# Altium schematic sheet ETH10M100M_RMII_DP83825.SchDoc
size A3; SheetNumber: 15; SheetTotal: 27
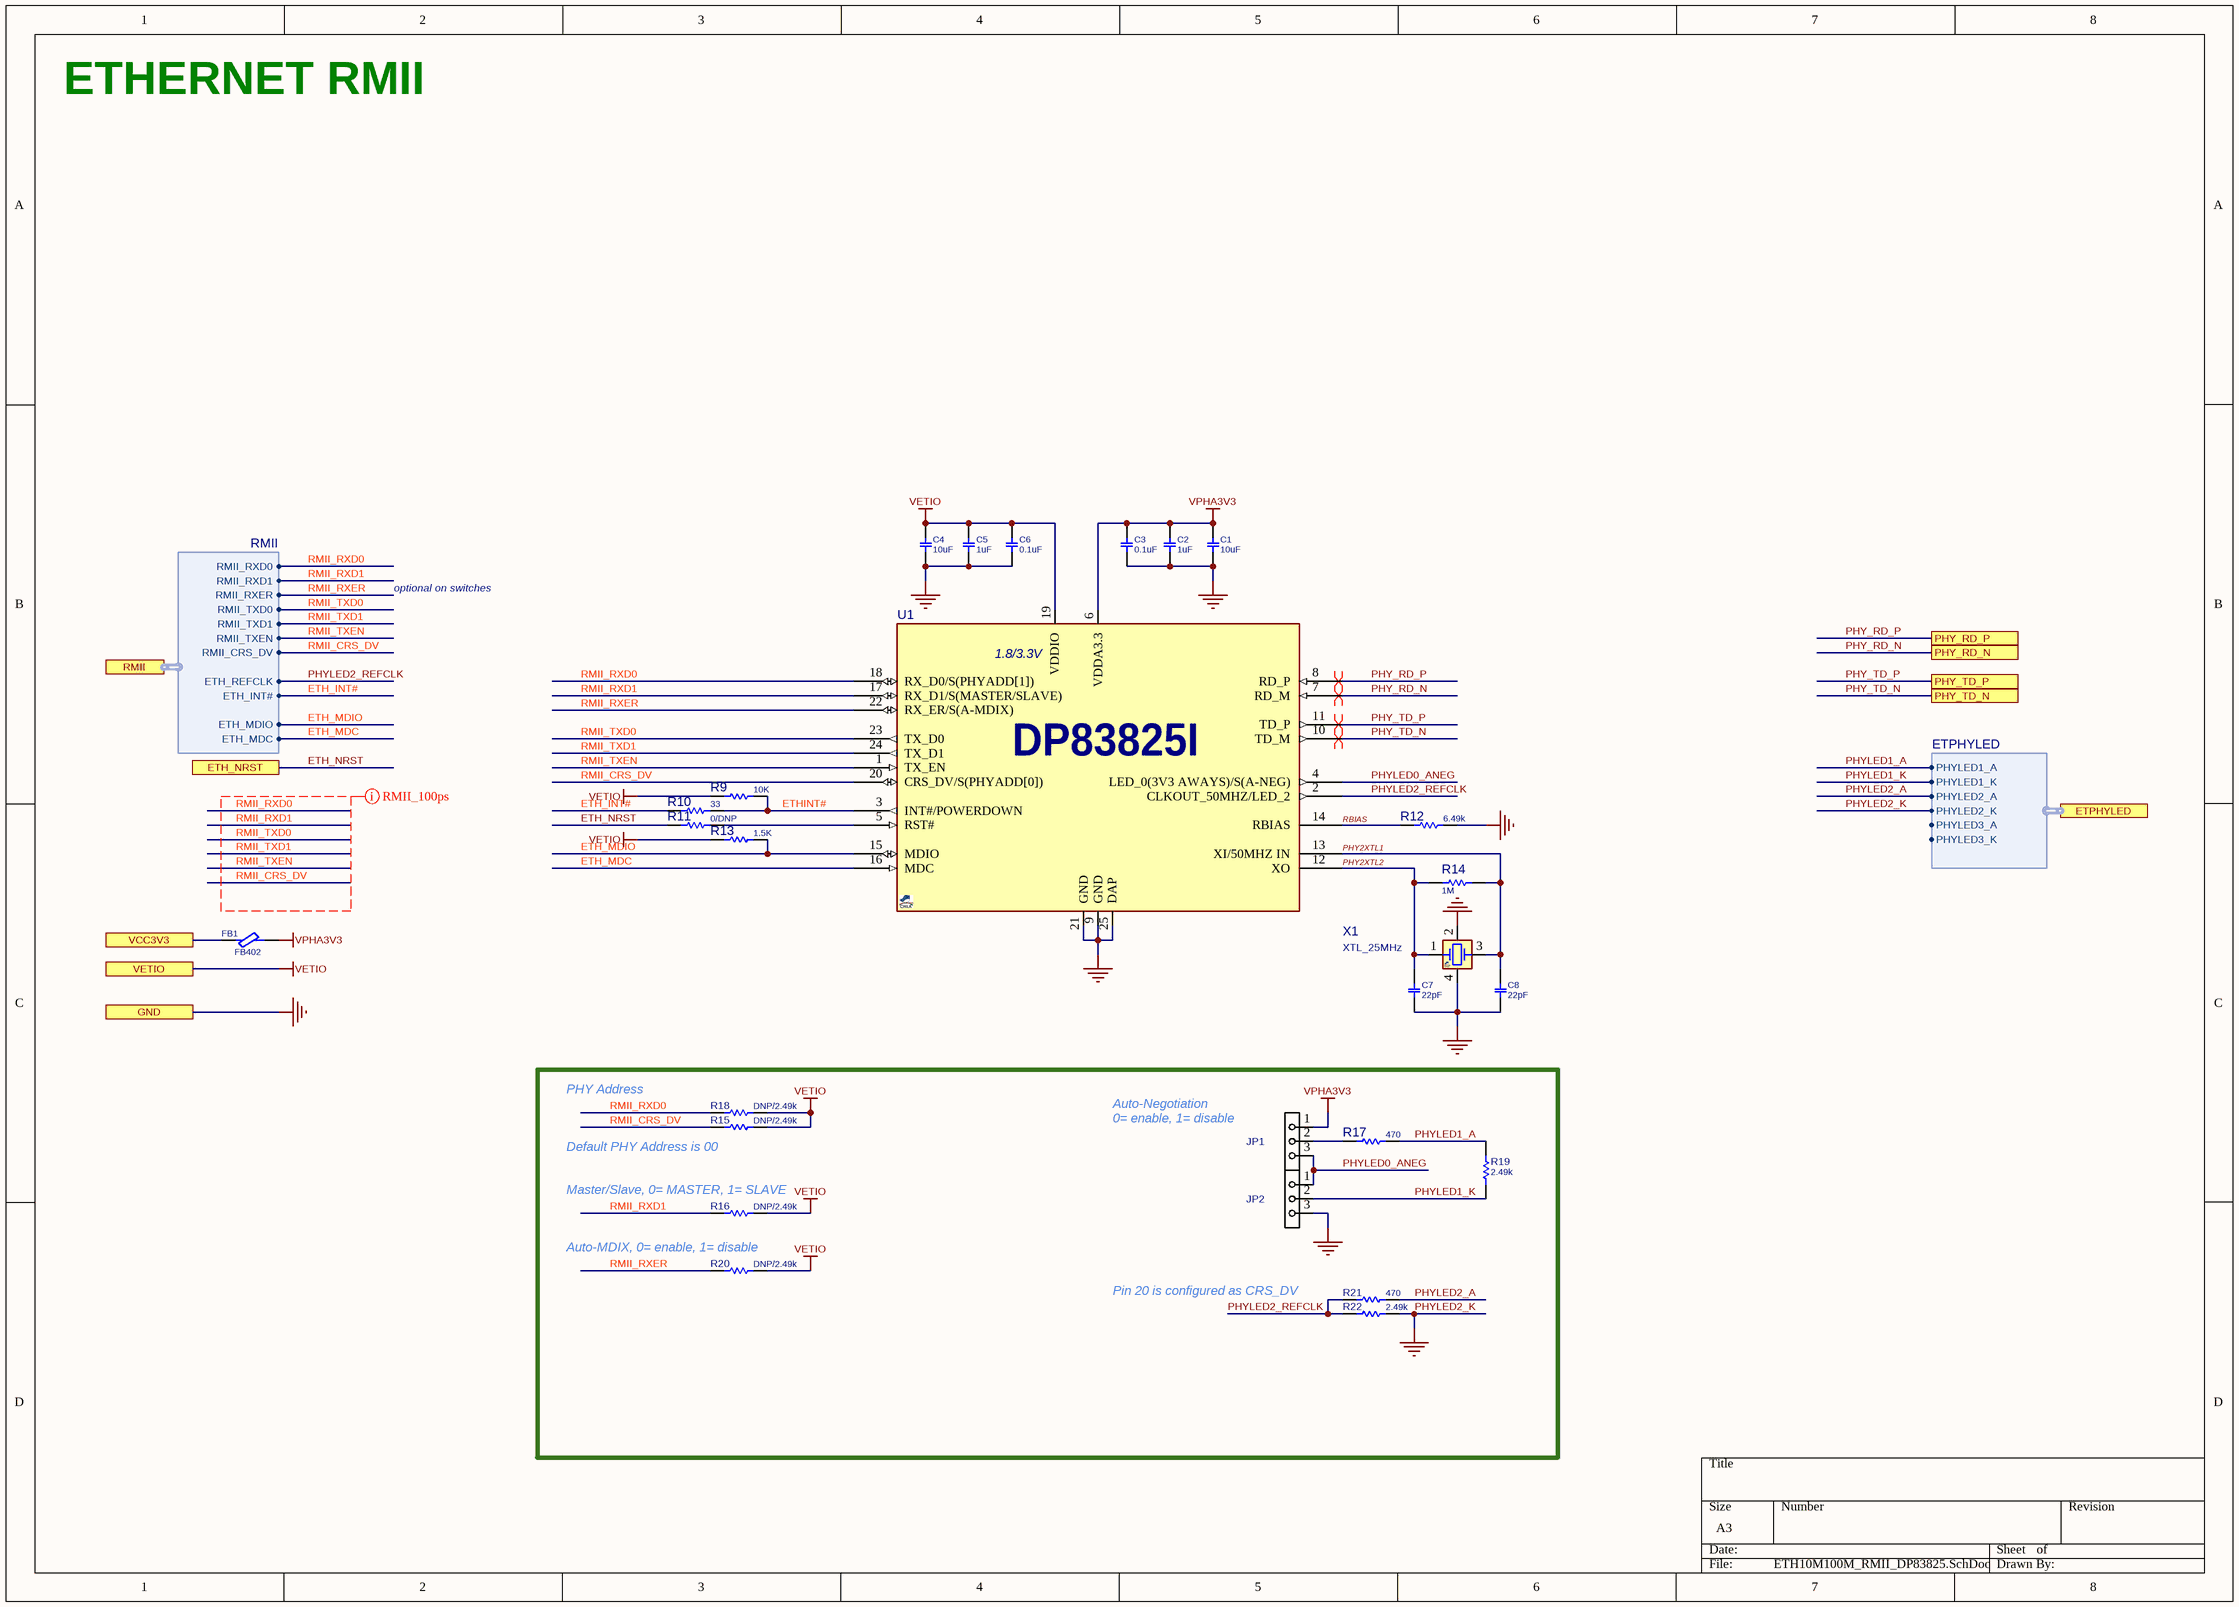
[diagram p0: ETH10M100M_RMII_DP83825.SchDoc]

## Parts
C1  10uF  [C0402]
C2  1uF  [C0402]
C3  0.1uF  [C0402]
C4  10uF  [C0402]
C5  1uF  [C0402]
C6  0.1uF  [C0402]
C7  22pF  [C0402]
C8  22pF  [C0402]
FB1  FB402  [L0402]
JP1  JMPHDR3PIN  [JP_3_60W]  (value not drawn)
JP2  JMPHDR3PIN  [JP_3_60W]  (value not drawn)
R9  10K  [R0402]
R10  33  [R0402]
R11  0/DNP  [R0402]
R12  6.49k  [R0402]
R13  1.5K  [R0402]
R14  1M  [R0402]
R15  DNP/2.49k  [R0402]
R16  DNP/2.49k  [R0402]
R17  470  [R0402]
R18  DNP/2.49k  [R0402]
R19  2.49k  [R0402]
R20  DNP/2.49k  [R0402]
R21  470  [R0402]
R22  2.49k  [R0402]
U1  DP83825I  [QFN40_24T_3X3_RMQ]  (value not drawn)
X1  XTL_25MHz  [XTL_4_2016]

## Ports
ETH_NRST, ETPHYLED (harness ETPHYLED), GND, PHY_RD_N, PHY_RD_P, PHY_TD_N, PHY_TD_P, RMII (harness RMII), VCC3V3, VETIO

## Harnesses
RMII: RMII_RXD0, RMII_RXD1, RMII_TXD0, RMII_TXD1, RMII_TXEN, RMII_CRS_DV, ETH_REFCLK, ETH_MDIO, ETH_MDC, RMII_RXER, ETH_INT#
ETPHYLED: PHYLED1_A, PHYLED1_K, PHYLED2_A, PHYLED2_K, PHYLED3_A, PHYLED3_K

## Nets
PHYLED2_K: C1.2 C2.2 C3.2 C4.2 C5.2 C6.2 C7.2 C8.2 JP2.3 R12.1 R22.1 U1.9(GND) U1.21(GND) U1.25(DAP) X1.2(GND1) X1.4(GND2) ; port GND, port ETPHYLED.PHYLED2_K  [also labelled GND]
VETIO: C4.1 C5.1 C6.1 R9.2 R13.2 R15.2 R16.2 R18.2 R20.1 U1.19(VDDIO) ; port VETIO
VPHA3V3: C1.1 C2.1 C3.1 FB1.2 JP1.1 U1.6(VDDA3.3)
ETH_INT#: R10.2 ; port RMII.ETH_INT#
ETH_MDC: U1.16(MDC) ; port RMII.ETH_MDC
ETH_MDIO: R13.1 U1.15(MDIO) ; port RMII.ETH_MDIO
ETH_NRST: R11.2 ; port ETH_NRST
ETHINT#: R9.1 R10.1 U1.3(INT#/POWERDOWN)
PHY2XTL1: C8.1 R14.2 U1.13(XI/50MHZ_IN) X1.3(XB)
PHY2XTL2: C7.1 R14.1 U1.12(XO) X1.1(XA)
PHY_RD_N: U1.7(RD_M) ; port PHY_RD_N
PHY_RD_P: U1.8(RD_P) ; port PHY_RD_P
PHY_TD_N: U1.10(TD_M) ; port PHY_TD_N
PHY_TD_P: U1.11(TD_P) ; port PHY_TD_P
PHYLED0_ANEG: JP1.3 JP2.1 U1.4(LED_0(3V3_AWAYS)/S(A-NEG))
PHYLED1_A: R17.2 R19.2 ; port ETPHYLED.PHYLED1_A
PHYLED1_K: JP2.2 R19.1 ; port ETPHYLED.PHYLED1_K
PHYLED2_A: R21.2 ; port ETPHYLED.PHYLED2_A
PHYLED2_REFCLK: R21.1 R22.2 U1.2(CLKOUT_50MHZ/LED_2) ; port RMII.ETH_REFCLK
RBIAS: R12.2 U1.14(RBIAS)
RMII_CRS_DV: R15.1 U1.20(CRS_DV/S(PHYADD[0])) ; port RMII.RMII_CRS_DV
RMII_RXD0: R18.1 U1.18(RX_D0/S(PHYADD[1])) ; port RMII.RMII_RXD0
RMII_RXD1: R16.1 U1.17(RX_D1/S(MASTER/SLAVE)) ; port RMII.RMII_RXD1
RMII_RXER: R20.2 U1.22(RX_ER/S(A-MDIX)) ; port RMII.RMII_RXER
RMII_TXD0: U1.23(TX_D0) ; port RMII.RMII_TXD0
RMII_TXD1: U1.24(TX_D1) ; port RMII.RMII_TXD1
RMII_TXEN: U1.1(TX_EN) ; port RMII.RMII_TXEN
VCC3V3: FB1.1 ; port VCC3V3
NetJP1_2: JP1.2 R17.1
NetR11_1: R11.1 U1.5(RST#)

## Layout directives
differential pair: PHY_RD_N, PHY_RD_P, PHY_TD_N, PHY_TD_P
net class RMII: RMII_CRS_DV, RMII_RXD0, RMII_RXD1, RMII_TXD0, RMII_TXD1, RMII_TXEN

## Notes on the sheet
- ETHERNET RMII
- optional on switches
- PHY Address
- Auto-Negotiation
- 0= enable, 1= disable
- (near R15) Default PHY Address is 00
- (near R16) Master/Slave, 0= MASTER, 1= SLAVE
- (near R20) Auto-MDIX, 0= enable, 1= disable
- Pin 20 is configured as CRS_DV
- (in symbol DP83825I_QFN24) 1.8/3.3V

## Library data of the parts
C1-C8 = CAP_SMD_MLCC_100n50TDK: CAP, MLCC; PARAM2: 50V; PARAM: -; MANF_P#: -; MANF: -; ASSEMBLY: ASSEMBLY; PRICE: -
  C1 C4: VALUE: 10uF
  C2 C5: VALUE: 1uF
  C3 C6: VALUE: 0.1uF
  C7 C8: VALUE: 22pF
FB1 = FBEAD_SMD_BLM18KG601: FERRITE_Bead; MANF: -; PARAM: -; PARAM2: -; MANF_P#: -; PRICE: 0.1$; VALUE: FB402
JP1 JP2 = JUMPER_SOLDER_3P: JUMPER, HEADER 3PIN; MANF: MANF; MANF_P#: MANF_P#; VALUE: JMPHDR3PIN
R9-R13 R15-R22 = RES_SMD_1K_0402YK: RESISTOR, SMD, THICK FILM, YAGEO; MANF_P#: RC0402FR-071KL; PARAM: 0.063W; DESC: DESCRIPTION; DIST#: MOUSER; PARAM2: 1%; MANF: Yageo; ASSEMBLY: ASSEMBLY; PRICE: 100= 0.3$
  R9: VALUE: 10K
  R10: VALUE: 33
  R11: VALUE: 0/DNP
  R12: VALUE: 6.49k
  R13: VALUE: 1.5K
  R15 R16 R18 R20: VALUE: DNP/2.49k
  R17 R21: VALUE: 470
  R19 R22: VALUE: 2.49k
R14 = RES_SMD_10K_0402: RESISTOR, SMD; MANF: Yageo; PARAM: 0.063W; DESC: DESCRIPTION; DIST#: MOUSER; PARAM2: 1%; MANF_P#: RC0402FR-071ML; ASSEMBLY: ASSEMBLY; PRICE: 100= 0.8$; VALUE: 1M
U1 = DP83825I_QFN24: Ethernet Transceiver, 10/100, RMII; MANF: Texas Instruments; MANF_P#: DP83825IRMQ; PARAM2: 1.8/3.3VIO; PRICE: -$; VALUE: DP83825I
X1 = XTL_4_25MHz_3225: CRYSTAL 25.00 MHZ; PARAM: 10PPM; DESC: DESCRIPTION; DIST#: MOUSER; PARAM2: PARAM; MANF_P#: china; MANF: -; ASSEMBLY: ASSEMBLY; PRICE: 0.5$; VALUE: XTL_25MHz